# Altium schematic sheet NE555DXZD.SchDoc
size A4
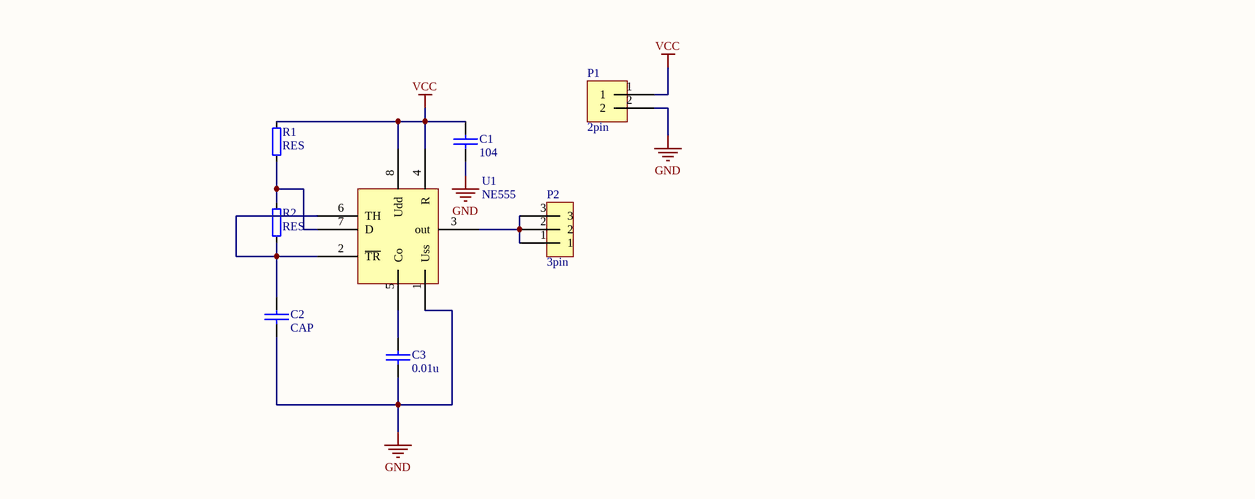
[diagram p0: NE555DXZD.SchDoc]

## Parts
C1  104  [RAD0.1]
C2  CAP  [RAD0.1]
C3  0.01u  [RAD0.1]
P1  2pin  [2pin针]
P2  3pin  [3PIN排针]
R1  RES  [AXIAL0.4]
R2  RES  [AXIAL0.4]
U1  NE555  [8pin座]

## Nets
GND: C1.2 C2.2 C3.2 P1.2 U1.1(Uss)
VCC: C1.1 P1.1 R1.2 U1.4(R) U1.8(Udd)
NetC2_1: C2.1 R2.1 U1.2(~{TR}) U1.6(TH)
NetC3_1: C3.1 U1.5(Co)
NetP2_1: P2.1 P2.2 P2.3 U1.3(out)
NetR1_1: R1.1 R2.2 U1.7(D)

## Library data of the parts
C1 C3 = CAP